# EAGLE design Stereo_mixer_v3 (EAGLE 9.0.0)
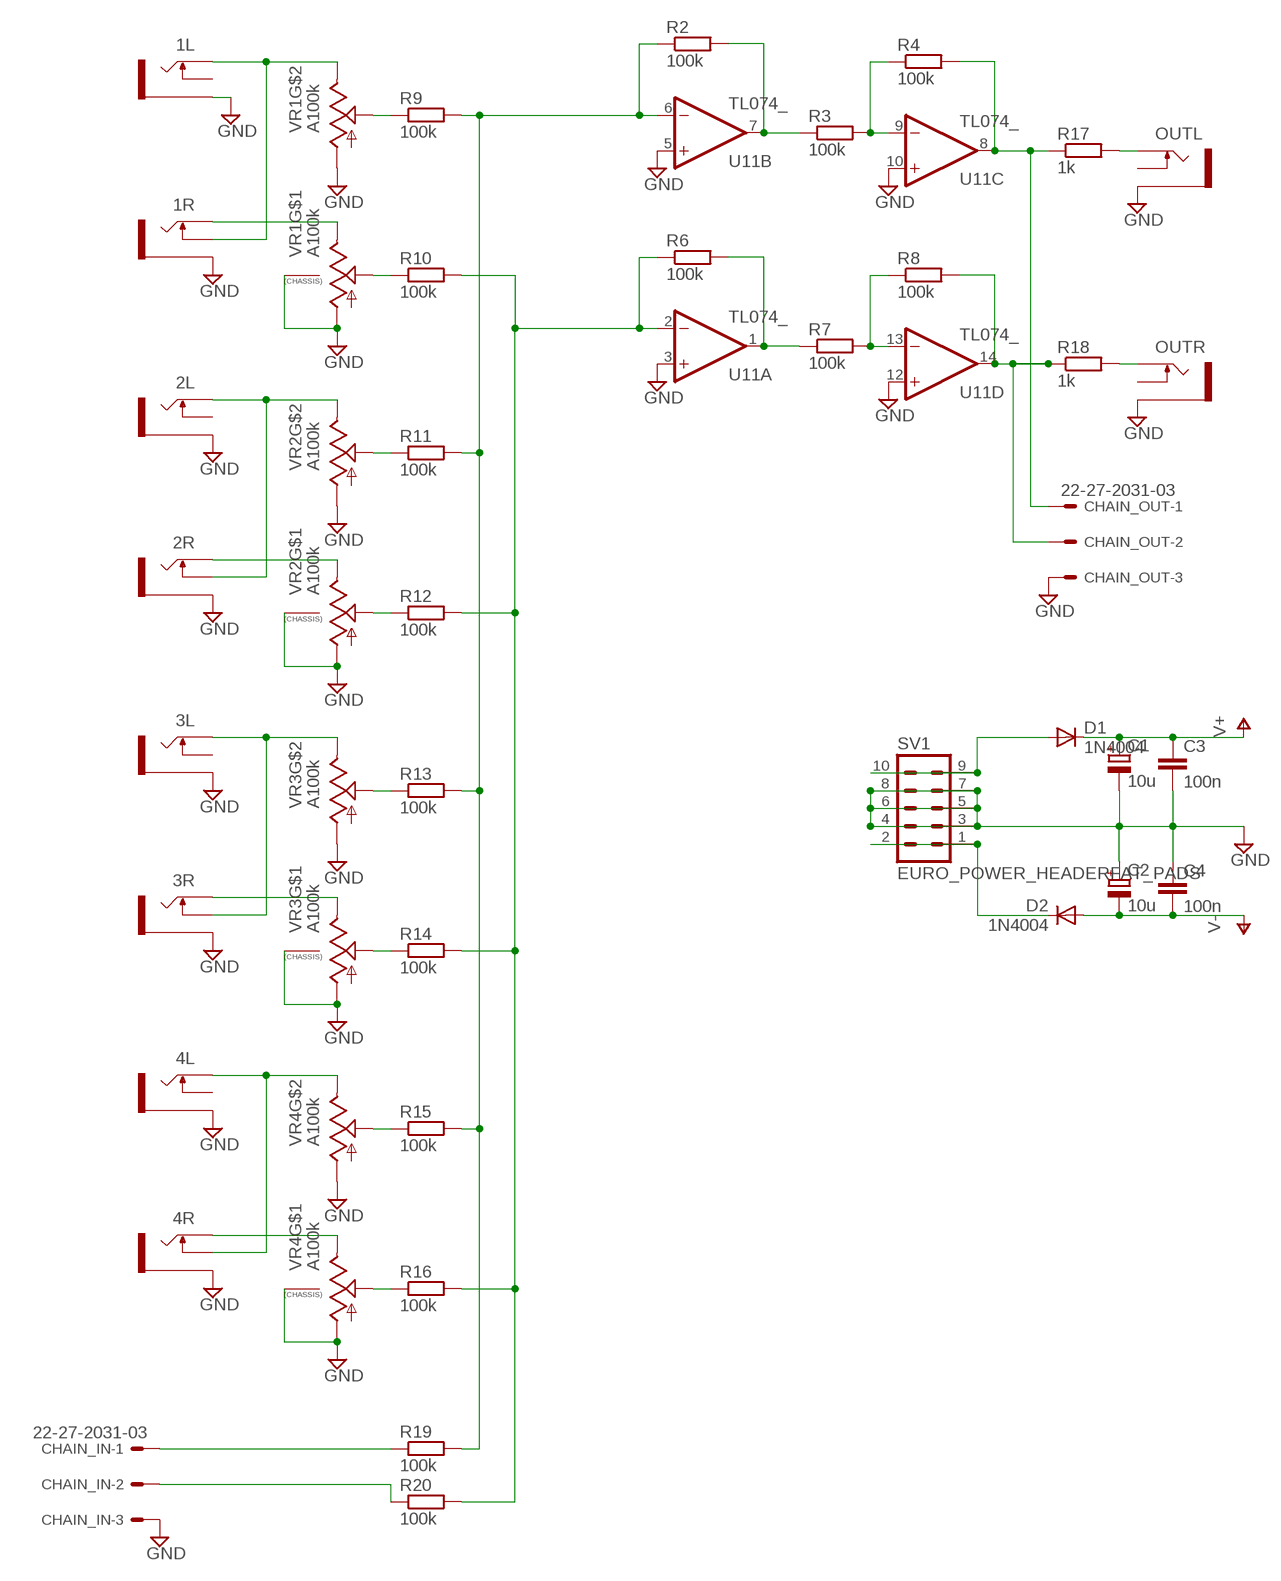
[diagram p0: schematic, sheet 1]

## Parts
1L  THONKICONNNEW  [WQP-PJ301M-12_JACK]
1R  THONKICONNNEW  [WQP-PJ301M-12_JACK]
2L  THONKICONNNEW  [WQP-PJ301M-12_JACK]
2R  THONKICONNNEW  [WQP-PJ301M-12_JACK]
3L  THONKICONNNEW  [WQP-PJ301M-12_JACK]
3R  THONKICONNNEW  [WQP-PJ301M-12_JACK]
4L  THONKICONNNEW  [WQP-PJ301M-12_JACK]
4R  THONKICONNNEW  [WQP-PJ301M-12_JACK]
C1  10u  CPOL-EUE2.5-6  [E2,5-6]
C2  10u  CPOL-EUE2.5-6  [E2,5-6]
C3  100n  C-EU025-024X044  [C025-024X044]
C4  100n  C-EU025-024X044  [C025-024X044]
CHAIN_IN  22-27-2031-03  [6410-03]
CHAIN_OUT  22-27-2031-03  [6410-03]
D1  1N4004  [DO41-10]
D2  1N4004  [DO41-10]
OUTL  THONKICONNNEW  [WQP-PJ301M-12_JACK]
OUTR  THONKICONNNEW  [WQP-PJ301M-12_JACK]
R2  100k  R-EU_0207/7  [0207/7]
R3  100k  R-EU_0207/7  [0207/7]
R4  100k  R-EU_0207/7  [0207/7]
R6  100k  R-EU_0207/7  [0207/7]
R7  100k  R-EU_0207/7  [0207/7]
R8  100k  R-EU_0207/7  [0207/7]
R9  100k  R-EU_0207/7  [0207/7]
R10  100k  R-EU_0207/7  [0207/7]
R11  100k  R-EU_0207/7  [0207/7]
R12  100k  R-EU_0207/7  [0207/7]
R13  100k  R-EU_0207/7  [0207/7]
R14  100k  R-EU_0207/7  [0207/7]
R15  100k  R-EU_0207/7  [0207/7]
R16  100k  R-EU_0207/7  [0207/7]
R17  1k  R-EU_0207/7  [0207/7]
R18  1k  R-EU_0207/7  [0207/7]
R19  100k  R-EU_0207/7  [0207/7]
R20  100k  R-EU_0207/7  [0207/7]
SV1  EURO_POWER_HEADERFAT_PADS  [EURO_PWR_HEADER_FAT]
U11  TL074_  [DIL14]
VR1  A100k  ALPHA-9MM-DUALPOT  [DUAL_9MM_SNAP-IN_POT]
VR2  A100k  ALPHA-9MM-DUALPOT  [DUAL_9MM_SNAP-IN_POT]
VR3  A100k  ALPHA-9MM-DUALPOT  [DUAL_9MM_SNAP-IN_POT]
VR4  A100k  ALPHA-9MM-DUALPOT  [DUAL_9MM_SNAP-IN_POT]

## Nets
GND: 1L.P$3_SLEEVE(SLEEVE) 1R.P$3_SLEEVE(SLEEVE) 2L.P$3_SLEEVE(SLEEVE) 2R.P$3_SLEEVE(SLEEVE) 3L.P$3_SLEEVE(SLEEVE) 3R.P$3_SLEEVE(SLEEVE) 4L.P$3_SLEEVE(SLEEVE) 4R.P$3_SLEEVE(SLEEVE) C1.- C2.+ C3.2 C4.1 CHAIN_IN.3 CHAIN_OUT.3 OUTL.P$3_SLEEVE(SLEEVE) OUTR.P$3_SLEEVE(SLEEVE) SV1.3 SV1.4 SV1.5 SV1.6 SV1.7 SV1.8 U11.3(A:+IN) U11.5(B:+IN) U11.10(C:+IN) U11.12(D:+IN) VR1.1(A) VR1.1B(A) VR1.CHASSIS1 VR1.CHASSIS2 VR2.1(A) VR2.1B(A) VR2.CHASSIS1 VR2.CHASSIS2 VR3.1(A) VR3.1B(A) VR3.CHASSIS1 VR3.CHASSIS2 VR4.1(A) VR4.1B(A) VR4.CHASSIS1 VR4.CHASSIS2
N$1: 1L.P$1_TIP(TIP) 1R.P$2_SWITCH(SWITCH) VR1.3B(E)
N$2: R9.1 VR1.2B(S)
N$3: 1R.P$1_TIP(TIP) VR1.3(E)
N$4: R10.1 VR1.2(S)
N$5: 2L.P$1_TIP(TIP) 2R.P$2_SWITCH(SWITCH) VR2.3B(E)
N$6: D1.A SV1.9 SV1.10
N$7: R11.1 VR2.2B(S)
N$8: 2R.P$1_TIP(TIP) VR2.3(E)
N$9: R12.1 VR2.2(S)
N$10: 3L.P$1_TIP(TIP) 3R.P$2_SWITCH(SWITCH) VR3.3B(E)
N$11: R13.1 VR3.2B(S)
N$12: 3R.P$1_TIP(TIP) VR3.3(E)
N$13: R14.1 VR3.2(S)
N$14: R15.1 VR4.2B(S)
N$15: 4L.P$1_TIP(TIP) 4R.P$2_SWITCH(SWITCH) VR4.3B(E)
N$16: 4R.P$1_TIP(TIP) VR4.3(E)
N$17: R16.1 VR4.2(S)
N$19: CHAIN_IN.1 R19.1
N$20: CHAIN_IN.2 R20.1
N$21: R2.1 R9.2 R11.2 R13.2 R15.2 R19.2 U11.6(B:-IN)
N$22: R6.1 R10.2 R12.2 R14.2 R16.2 R20.2 U11.2(A:-IN)
N$23: R3.2 R4.1 U11.9(C:-IN)
N$24: R7.2 R8.1 U11.13(D:-IN)
N$25: OUTL.P$1_TIP(TIP) R17.2
N$26: OUTR.P$1_TIP(TIP) R18.2
N$27: R6.2 R7.1 U11.1(A:OUT)
N$28: CHAIN_OUT.2 R8.2 R18.1 U11.14(D:OUT)
N$29: CHAIN_OUT.1 R4.2 R17.1 U11.8(C:OUT)
N$30: R2.2 R3.1 U11.7(B:OUT)
N$35: D2.C SV1.1 SV1.2
V+: C1.+ C3.1 D1.C
V-: C2.- C4.2 D2.A
Unconnected: 1L.P$2_SWITCH(SWITCH) 2L.P$2_SWITCH(SWITCH) 3L.P$2_SWITCH(SWITCH) 4L.P$2_SWITCH(SWITCH) OUTL.P$2_SWITCH(SWITCH) OUTR.P$2_SWITCH(SWITCH)

## Power pins joined to a net without a drawn wire
V+: U11.4(P:V+)
V-: U11.11(P:V-)

## Library data of the parts
1L 1R 2L 2R 3L 3R 4L 4R OUTL OUTR = MusicThingModular:THONKICONN: 3.5mm socket for Eurorack modular synths
C1 C2 = rcl:CPOL-EU: POLARIZED CAPACITOR, European symbol; SPICEPREFIX: C
C3 C4 = rcl:C-EU: CAPACITOR, European symbol; SPICEPREFIX: C
CHAIN_IN CHAIN_OUT = con-molex:22-?-03: CONNECTOR wire to board 2.54 mm (.1 inch) pitch header; MF: MOLEX; OC_FARNELL: unknown; OC_NEWARK: unknown
D1 D2 = diode:1N4004: DIODE general purpose rectifier, 1 A
R2-R4 R6-R20 = resistor:R-EU_: RESISTOR, European symbol
SV1 = MusicThingModular:EURO_POWER_HEADER: Power Header 10 pin power header for Eurorack Power Supplies Variants with fatter pads for easier soldering, and the LOCK variant which has 5mil offset pins to hold the component in place before soldering
U11 = MusicThingModular:TL074: Generic Quad Op Amp
VR1-VR4 = MusicThingModular:ALPHA-9MM-DUALPOT: 9mm vertical snap-in pot, Alpha / Panasonic style, with a connection to the metal chassis for grounding

## Board
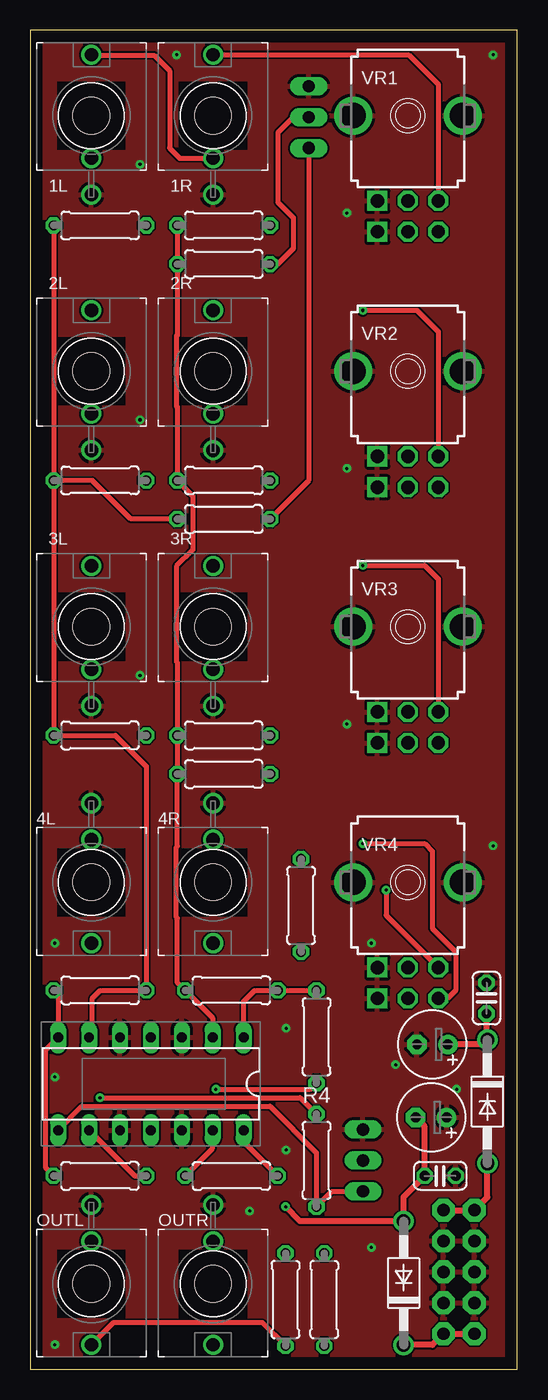
[diagram p1: board, top side]
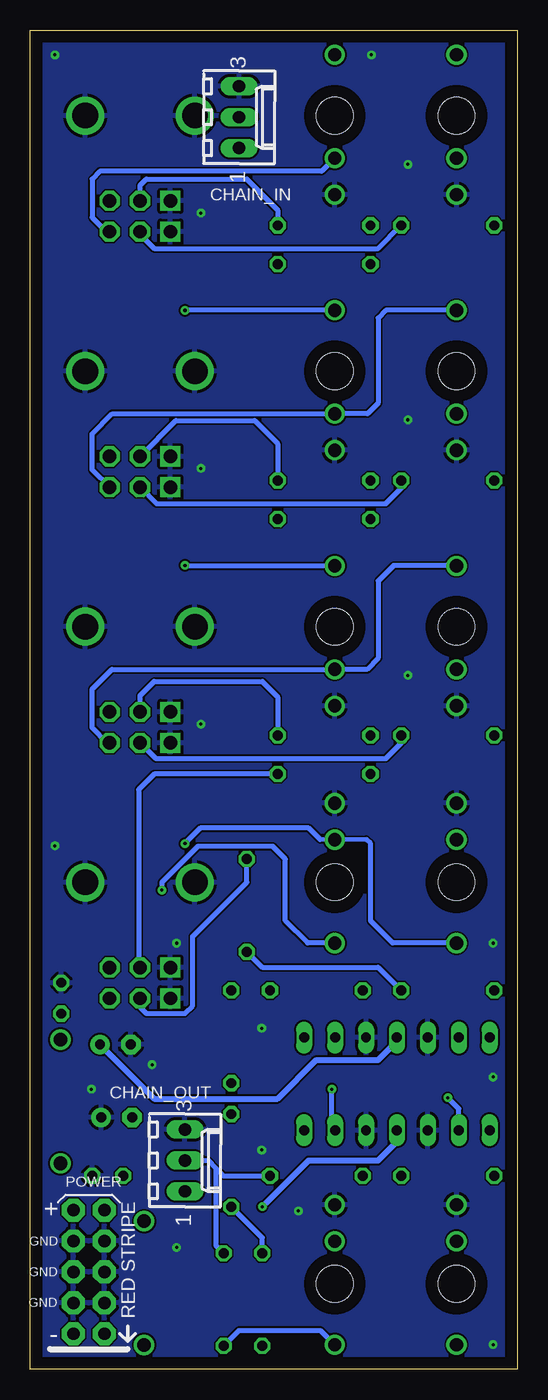
[diagram p2: board, bottom side, seen from below]

Size 40 x 110 mm. Coordinates in mm from the lower left corner, seen from the top.
Outline: 0,0 40,0 40,110 0,110 0,0
Copper layers (1*16): Top 0.035mm / dielectric 1.5mm / Bottom 0.035mm
Design rules "default *": minimum track width 6mil, minimum drill 0.25mm, track to track 6mil, track to pad 6mil, pad to pad 6mil, via to via 6mil, smd to smd 6mil, copper to edge 40mil, drill to drill 6mil, minimum pad ring 10mil, minimum via ring 8mil, stop-mask expansion 4mil, vias tented up to drill 0mil, thermal gap 10mil
Holes 3 mm at 5,61 15,61 5,40 5,7 15,7 15,82 5,82 5,103 15,103 15,40

### Footprints (pad centres in the part's own frame; a part is rotated, then mirrored left to right if it is on the bottom)
WQP-PJ301M-12_JACK = drill 1.1: P$1_TIP 0,5; P$2_SWITCH 0,-3.5; P$3_SLEEVE 0,-6.5
E2,5-6 = drill 0.813 pad 1.6: + -1.27,0 | drill 0.813 pad 1.6 octagon: - 1.27,0
C025-024X044 = drill 0.813 octagon: 1 -1.27,0; 2 1.27,0
6410-03 = drill 1.016 long: 1 2.54,0; 2 0,0; 3 -2.54,0
DO41-10 = drill 1.118: A 5.08,0; C -5.08,0
0207/7 = drill 0.813 octagon: 1 -3.81,0; 2 3.81,0
EURO_PWR_HEADER_FAT = drill 1.016 pad 1.88 octagon: 1 -5.08,-1.27; 2 -5.08,1.27; 3 -2.54,-1.27; 4 -2.54,1.27; 5 0,-1.27; 6 0,1.27; 7 2.54,-1.27; 8 2.54,1.27; 9 5.08,-1.27; 10 5.08,1.27
DIL14 = drill 0.813 long: 1 -7.62,-3.81; 2 -5.08,-3.81; 3 -2.54,-3.81; 4 0,-3.81; 5 2.54,-3.81; 6 5.08,-3.81; 7 7.62,-3.81; 8 7.62,3.81; 9 5.08,3.81; 10 2.54,3.81; 11 0,3.81; 12 -2.54,3.81; 13 -5.08,3.81; 14 -7.62,3.81
DUAL_9MM_SNAP-IN_POT = drill 1.1 square: 1 -2.5,-7; 1B -2.5,-9.54 | drill 1.1 octagon: 2 0,-7; 2B 0,-9.54; 3 2.5,-7; 3B 2.5,-9.54 | drill 2.1 pad 2.54: CHASSIS1 -4.5,0; CHASSIS2 4.5,0

### Placement (x,y rotation side)
1L  5,103 0 top
1R  15,103 0 top
2L  5,82 0 top
2R  15,82 0 top
3L  5,61 0 top
3R  15,61 0 top
4L  5,40 180 top
4R  15,40 180 top
C1  33.02,26.67 180 top
C2  32.91,20.68 180 top
C3  37.47,30.48 90 top
C4  33.66,15.88 180 top
CHAIN_IN  22.86,102.87 270 bottom
CHAIN_OUT  27.3,17.14 270 bottom
D1  37.53,21.99 270 top
D2  30.66,7.07 90 top
OUTL  5,7 180 top
OUTR  15,7 180 top
R2  5.71,31.11 180 top
R3  5.71,15.88 0 top
R4  23.5,17.14 270 top
R6  16.51,31.11 0 top
R7  23.5,27.3 270 top
R8  16.51,15.88 0 top
R9  5.71,93.98 180 top
R10  15.88,93.98 180 top
R11  5.71,73.03 180 top
R12  15.88,73.03 180 top
R13  5.71,52.07 180 top
R14  15.88,52.07 180 top
R15  22.23,38.1 270 top
R16  15.88,48.9 180 top
R17  20.95,5.71 270 top
R18  24.13,5.71 270 top
R19  15.88,69.85 180 top
R20  15.88,90.81 180 top
SV1  35.2,7.98 90 bottom
U11  9.89,23.44 180 top
VR1  31,103 0 top
VR2  31,82 0 top
VR3  31,61 0 top
VR4  31,40 0 top

### Tracks (layer width: path | path; a pad name or v marks a point on that pad's centre or on a via)
GND  (via drill 0.25 pad 0.7)
  other vias: 2,2 2,24 2,35 9,57 9,78 9,99 12,108 38,108 26,95 26,74 26,53 28,35 21,28 21,18 18,13 28,10 30,25 35,23 38,43
  pour Bottom: 0,110 0,0 40,0 40,110
  pour Top: 0,110 0,0 40,0 40,110
N$1
  Top 0.406: 1L.P$1_TIP 5.05,107.95 10.16,107.95 11.43,106.68 11.43,100.33 12.26,99.5 1R.P$2_SWITCH
  Bottom 0.406: 1R.P$2_SWITCH 16.07,98.42 34.29,98.42 34.92,97.79 34.92,94.61 33.77,93.46 VR1.3B
N$2
  Bottom 0.406: VR1.2B 31,93.23 29.84,92.08 11.43,92.08 R9.1
N$3
  Top 0.406: 1R.P$1_TIP 31.07,108 33.5,105.56 VR1.3
N$4
  Bottom 0.406: R10.1 19.68,95.25 22.23,97.79 30.48,97.79 31,97.27 VR1.2
N$5
  Bottom 0.406: VR2.3B 34.92,73.89 34.92,76.83 33.26,78.5 15.24,78.5 2R.P$2_SWITCH 12.3,78.5 11.43,79.38 11.43,86.36 10.79,87 2L.P$1_TIP
N$6
  Top 0.508: SV1.9 SV1.10 37.53,14.12 D1.A
N$7
  Bottom 0.406: VR2.2B 29.66,71.12 10.79,71.12 9.53,72.39 R11.1
N$8  (via drill 0.25 pad 0.7)
  Top 0.406: v27.3,87 31.75,87 33.5,85.25 VR2.3
  Bottom 0.406: 2R.P$1_TIP v27.3,87
N$9
  Bottom 0.406: VR2.2 28.06,77.94 21.59,77.94 19.68,76.04 R12.1
N$10
  Bottom 0.406: VR3.3B 33.68,51.46 34.92,52.7 34.92,55.88 33.3,57.5 15.24,57.5 3R.P$2_SWITCH 12.35,57.5 11.43,58.42 11.43,64.77 10.16,66.04 5.04,66.04 3L.P$1_TIP
N$11
  Bottom 0.406: VR3.2B 29.7,50.16 10.79,50.16 9.53,51.44 R13.1
N$12  (via drill 0.25 pad 0.7)
  Top 0.406: v27.3,66.04 32.38,66.04 33.5,64.92 VR3.3
  Bottom 0.406: 3R.P$1_TIP 27.27,66 v27.3,66.04
N$13
  Bottom 0.406: VR3.2 31,55.36 29.84,56.52 20.95,56.52 19.68,55.24 R14.1
N$14
  Bottom 0.406: VR4.2B 31,29.73 30.48,29.21 27.3,29.21 26.67,29.84 26.67,35.56 22.23,40.01 R15.1
N$15  (via drill 0.25 pad 0.7)
  Top 0.406: v27.3,43.18 32.38,43.18 33.02,42.55 33.02,36.2 34.92,34.29 34.92,31.11 34.27,30.46 VR4.3B
  Bottom 0.406: 4L.P$1_TIP 10.24,35.01 12.06,36.83 12.06,43.18 12.39,43.51 4R.P$2_SWITCH 16.2,43.51 17.14,44.45 26.04,44.45 v27.3,43.18
N$16  (via drill 0.25 pad 0.7)
  Top 0.406: v29.21,39.37 29.21,37.29 VR4.3
  Bottom 0.406: 4R.P$1_TIP 17.23,35.01 19.05,36.83 19.05,41.91 20.09,42.95 26.25,42.95 29.21,40 v29.21,39.37
N$17
  Bottom 0.406: R16.1 29.84,48.9 31.11,47.62 31.11,33.12 VR4.2
N$19
  Top 0.406: CHAIN_IN.1 22.86,73.03 R19.1
N$20
  Top 0.406: CHAIN_IN.2 21.59,102.87 20.32,101.6 20.32,95.89 21.59,94.61 21.59,92.08 20.32,90.81 R20.1
N$21
  Top 0.406: R9.2 R11.2 | R11.2 R13.2 6.99,52.07 9.53,49.53 R2.1 5.71,31.11 5.08,30.48 5.08,27.52 U11.6 | R19.2 8.26,69.85 5.08,73.03 R11.2
  Bottom 0.406: R15.2 20.95,33.02 11.43,33.02 R2.1
N$22
  Top 0.406: R10.2 R20.2 12.06,84.95 12,84.88 12,79.12 12.06,79.05 R12.2 13.34,71.75 13.34,67.31 12,65.97 12,58.12 12.06,58.05 R14.2 12.06,49 R16.2 12.06,42.95 12,42.88 12,37.12 12.06,37.05 12.06,31.75 R6.1 14.97,28.84 U11.2
N$23  (via drill 0.25 pad 0.7)
  Top 0.406: U11.9 8.57,15.88 R3.2 | v5.71,22.3 22.15,22.3 R4.1
  Bottom 0.406: U11.9 4.82,21.4 v5.71,22.3
N$24  (via drill 0.25 pad 0.7)
  Top 0.406: R8.1 14.97,18.15 U11.13 | v15.24,23 23,23 R7.2
  Bottom 0.406: U11.13 15.24,19.89 v15.24,23
N$25
  Top 0.406: R17.2 19.05,3.81 6.81,3.81 OUTL.P$1_TIP
N$26
  Bottom 0.406: R18.2 22.86,3.17 16.18,3.17 OUTR.P$1_TIP
N$27
  Top 0.406: U11.1 17.52,30.21 18.41,31.11 R6.2 R7.1
N$28
  Top 0.406: R8.2 17.52,18.68 U11.14
  Bottom 0.406: CHAIN_OUT.2 25.4,17.14 24.77,16.51 | 24.77,16.51 24.77,10.16 R18.1 | 24.77,16.51 24.13,15.88 R8.2
N$29
  Top 0.406: U11.8 4.24,21.59 19.68,21.59 23.5,17.78 R4.2 24.77,14.61 CHAIN_OUT.1
  Bottom 0.406: R17.1 20.95,10.79 R4.2
N$30
  Top 0.406: R2.2 2.27,30.75 U11.7 1.22,26.19 1.22,16.56 R3.1
N$35
  Top 0.508: SV1.2 SV1.1 33.02,1.99 D2.C
V+
  Top 0.508: C1.+ 37.13,26.67 D1.C 37.47,27.14 C3.1
  Bottom 0.508: C1.+ 29.84,22.23 19.68,22.23 16.51,25.4 11.43,25.4 9.89,26.93 U11.4
V-  (via drill 0.25 pad 0.7)
  Top 0.508: C2.- 32.38,19.94 C4.2 30.66,14.15 D2.A 22.14,12.15 v20.95,13.34
  Bottom 0.508: v20.95,13.34 17.14,17.14 11.43,17.14 9.89,18.68 U11.11